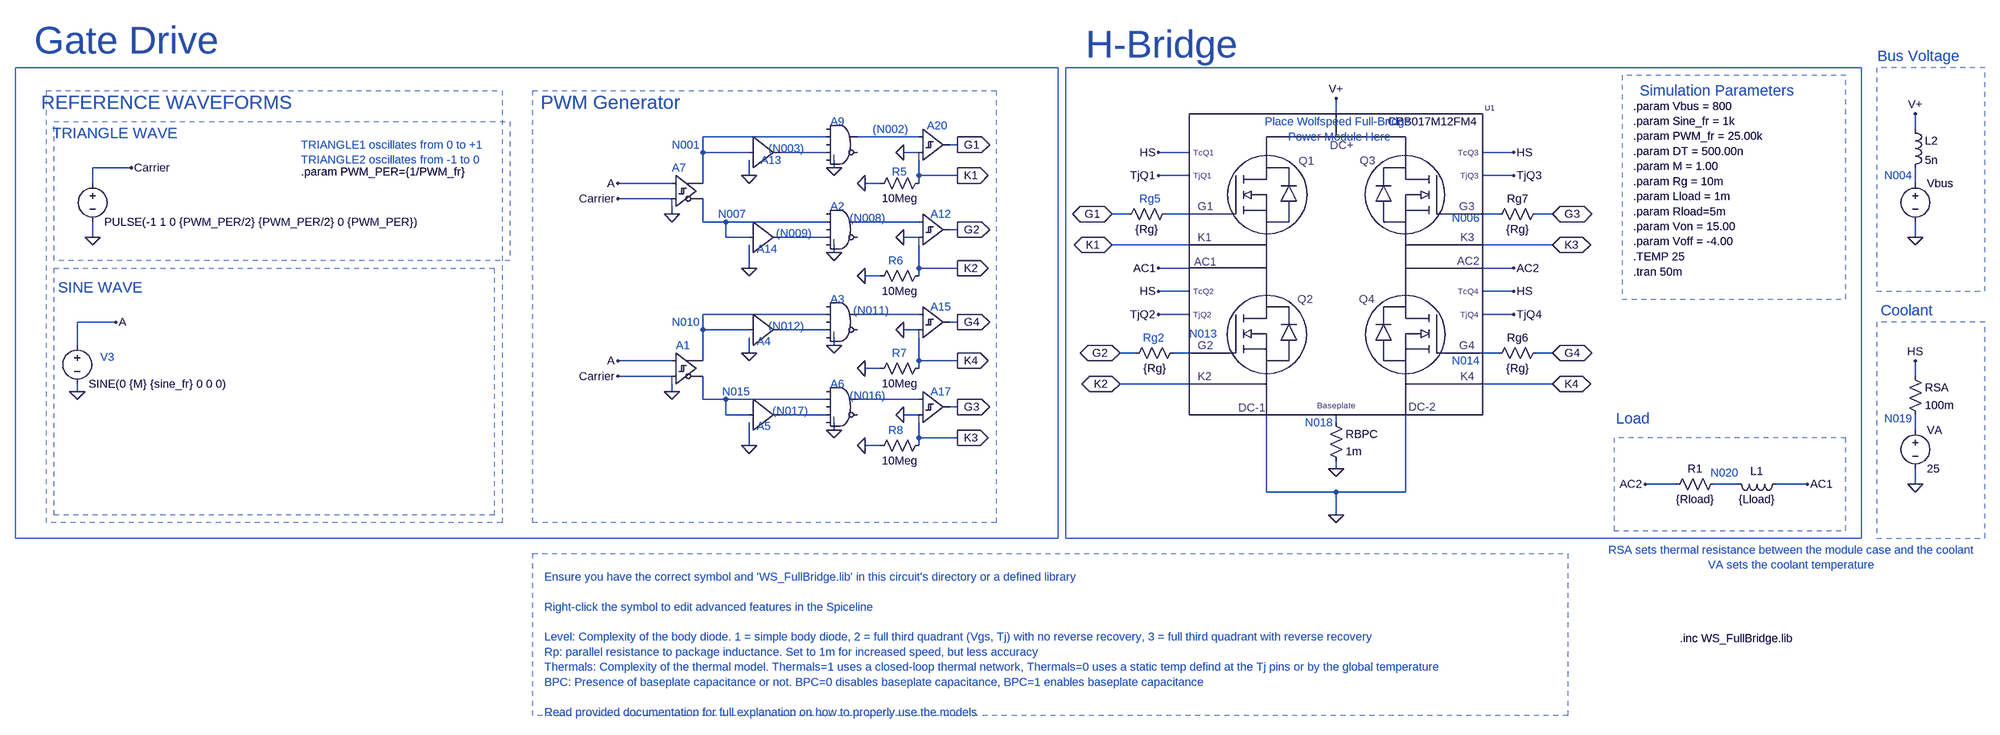
[diagram p0: schematic HBridge_FB.asc]
HBridge_FB.asc, the LTspice schematic file:
Version 4
SHEET 1 8028 1400
WIRE 3744 -2752 3744 -2784
WIRE 4944 -2720 4944 -2752
WIRE 2688 -2704 2432 -2704
WIRE 2880 -2704 2752 -2704
WIRE 2960 -2688 2944 -2688
WIRE 2432 -2672 2432 -2704
WIRE 2528 -2672 2432 -2672
WIRE 2688 -2672 2592 -2672
WIRE 2880 -2672 2848 -2672
WIRE 3440 -2672 3376 -2672
WIRE 4112 -2672 4048 -2672
WIRE 1248 -2640 1168 -2640
WIRE 2704 -2640 2704 -2656
WIRE 2528 -2624 2528 -2656
WIRE 2880 -2624 2880 -2656
WIRE 2960 -2624 2880 -2624
WIRE 3440 -2624 3376 -2624
WIRE 4112 -2624 4048 -2624
WIRE 1168 -2608 1168 -2640
WIRE 2368 -2608 2256 -2608
WIRE 2432 -2608 2432 -2672
WIRE 2800 -2608 2768 -2608
WIRE 2880 -2608 2880 -2624
WIRE 4944 -2608 4944 -2640
WIRE 2368 -2576 2256 -2576
WIRE 2368 -2544 2368 -2560
WIRE 3312 -2544 3280 -2544
WIRE 3440 -2544 3392 -2544
WIRE 4080 -2544 4048 -2544
WIRE 4192 -2544 4160 -2544
WIRE 2432 -2528 2432 -2576
WIRE 2480 -2528 2432 -2528
WIRE 2688 -2528 2480 -2528
WIRE 2880 -2528 2752 -2528
WIRE 2960 -2512 2944 -2512
WIRE 1168 -2496 1168 -2528
WIRE 2480 -2496 2480 -2528
WIRE 2528 -2496 2480 -2496
WIRE 2688 -2496 2592 -2496
WIRE 2880 -2496 2848 -2496
WIRE 4944 -2496 4944 -2528
WIRE 3440 -2480 3280 -2480
WIRE 4192 -2480 4048 -2480
WIRE 2704 -2464 2704 -2480
WIRE 2528 -2432 2528 -2480
WIRE 2880 -2432 2880 -2480
WIRE 2960 -2432 2880 -2432
WIRE 3440 -2432 3376 -2432
WIRE 4112 -2432 4048 -2432
WIRE 2800 -2416 2768 -2416
WIRE 2880 -2416 2880 -2432
WIRE 3440 -2384 3376 -2384
WIRE 4112 -2384 4048 -2384
WIRE 2688 -2336 2432 -2336
WIRE 2880 -2336 2752 -2336
WIRE 3440 -2336 3376 -2336
WIRE 4112 -2336 4048 -2336
WIRE 1216 -2320 1136 -2320
WIRE 2960 -2320 2944 -2320
WIRE 2432 -2304 2432 -2336
WIRE 2528 -2304 2432 -2304
WIRE 2688 -2304 2592 -2304
WIRE 2880 -2304 2848 -2304
WIRE 1136 -2272 1136 -2320
WIRE 2704 -2272 2704 -2288
WIRE 2528 -2256 2528 -2288
WIRE 3328 -2256 3296 -2256
WIRE 3440 -2256 3408 -2256
WIRE 4080 -2256 4048 -2256
WIRE 4192 -2256 4160 -2256
WIRE 2368 -2240 2256 -2240
WIRE 2432 -2240 2432 -2304
WIRE 2880 -2240 2880 -2288
WIRE 2960 -2240 2880 -2240
WIRE 2800 -2224 2768 -2224
WIRE 2880 -2224 2880 -2240
WIRE 2368 -2208 2256 -2208
WIRE 4944 -2208 4944 -2240
WIRE 3440 -2192 3296 -2192
WIRE 4192 -2192 4048 -2192
WIRE 1136 -2176 1136 -2192
WIRE 2368 -2176 2368 -2192
WIRE 2432 -2160 2432 -2208
WIRE 2480 -2160 2432 -2160
WIRE 2688 -2160 2480 -2160
WIRE 2880 -2160 2752 -2160
WIRE 2960 -2144 2944 -2144
WIRE 2480 -2128 2480 -2160
WIRE 2528 -2128 2480 -2128
WIRE 2688 -2128 2592 -2128
WIRE 2880 -2128 2848 -2128
WIRE 3744 -2112 3744 -2128
WIRE 2704 -2096 2704 -2112
WIRE 4944 -2096 4944 -2128
WIRE 2880 -2080 2880 -2112
WIRE 2960 -2080 2880 -2080
WIRE 2528 -2064 2528 -2112
WIRE 2800 -2064 2768 -2064
WIRE 2880 -2064 2880 -2080
WIRE 3744 -2016 3744 -2032
WIRE 4448 -1984 4384 -1984
WIRE 4576 -1984 4528 -1984
WIRE 4720 -1984 4656 -1984
WIRE 4944 -1984 4944 -2016
WIRE 3600 -1968 3600 -2128
WIRE 3744 -1968 3600 -1968
WIRE 3888 -1968 3888 -2128
WIRE 3888 -1968 3744 -1968
WIRE 3744 -1920 3744 -1968
FLAG 1168 -2496 0
FLAG 1248 -2640 Carrier
FLAG 4944 -2752 V+
FLAG 2368 -2544 0
FLAG 2704 -2640 0
FLAG 2704 -2464 0
FLAG 2960 -2688 G1
IOPIN 2960 -2688 Out
FLAG 2960 -2144 G3
IOPIN 2960 -2144 Out
FLAG 2960 -2512 G2
IOPIN 2960 -2512 Out
FLAG 2960 -2320 G4
IOPIN 2960 -2320 Out
FLAG 2960 -2240 K4
IOPIN 2960 -2240 Out
FLAG 2960 -2432 K2
IOPIN 2960 -2432 Out
FLAG 2960 -2624 K1
IOPIN 2960 -2624 Out
FLAG 2960 -2080 K3
IOPIN 2960 -2080 Out
FLAG 2528 -2432 0
FLAG 2848 -2672 0
FLAG 2848 -2496 0
FLAG 2848 -2304 0
FLAG 2848 -2128 0
FLAG 2256 -2608 A
FLAG 2528 -2624 0
FLAG 2368 -2176 0
FLAG 2704 -2272 0
FLAG 2704 -2096 0
FLAG 2528 -2064 0
FLAG 2256 -2240 A
FLAG 2528 -2256 0
FLAG 2768 -2608 0
FLAG 2768 -2416 0
FLAG 2768 -2224 0
FLAG 2768 -2064 0
FLAG 3296 -2256 G2
IOPIN 3296 -2256 BiDir
FLAG 3280 -2544 G1
IOPIN 3280 -2544 BiDir
FLAG 3296 -2192 K2
IOPIN 3296 -2192 BiDir
FLAG 3280 -2480 K1
IOPIN 3280 -2480 BiDir
FLAG 4192 -2544 G3
IOPIN 4192 -2544 BiDir
FLAG 4192 -2256 G4
IOPIN 4192 -2256 BiDir
FLAG 4192 -2192 K4
IOPIN 4192 -2192 BiDir
FLAG 4192 -2480 K3
IOPIN 4192 -2480 BiDir
FLAG 3744 -2784 V+
FLAG 3744 -1920 0
FLAG 4944 -2496 0
FLAG 4720 -1984 AC1
FLAG 1136 -2176 0
FLAG 1216 -2320 A
FLAG 2256 -2576 Carrier
FLAG 2256 -2208 Carrier
FLAG 4944 -2240 HS
FLAG 4944 -1984 0
FLAG 3744 -2016 0
FLAG 4112 -2432 AC2
FLAG 3376 -2432 AC1
FLAG 4384 -1984 AC2
FLAG 4112 -2672 HS
FLAG 3376 -2672 HS
FLAG 3376 -2384 HS
FLAG 4112 -2384 HS
FLAG 4112 -2624 TjQ3
FLAG 4112 -2336 TjQ4
FLAG 3376 -2624 TjQ1
FLAG 3376 -2336 TjQ2
SYMBOL voltage 1168 -2624 R0
WINDOW 123 0 0 Left 2
WINDOW 39 0 0 Left 2
WINDOW 0 24 16 Invisible 2
SYMATTR InstName V2
SYMATTR Value PULSE(-1 1 0 {PWM_PER/2} {PWM_PER/2} 0 {PWM_PER})
SYMBOL diffschmitt 2368 -2656 R0
WINDOW 3 8 120 Invisible 2
WINDOW 0 8 16 Invisible 2
SYMATTR Value tripdt=10n Vt=0
SYMATTR InstName A7
SYMBOL and 2720 -2752 R0
WINDOW 0 16 24 Invisible 2
WINDOW 3 16 112 Invisible 2
SYMATTR InstName A9
SYMATTR Value trise=10n tfall=10n
SYMBOL buf1 2528 -2736 R0
WINDOW 3 8 104 Invisible 2
WINDOW 0 8 32 Invisible 2
SYMATTR Value Td={DT} Trise=10n
SYMATTR InstName A13
SYMBOL buf1 2528 -2560 R0
WINDOW 3 8 104 Invisible 2
WINDOW 0 8 32 Invisible 2
SYMATTR Value Td={DT} Trise=10n
SYMATTR InstName A14
SYMBOL diffschmitt 2368 -2288 R0
WINDOW 3 8 120 Invisible 2
WINDOW 0 8 16 Invisible 2
SYMATTR Value tripdt=10n Vt=0
SYMATTR InstName A1
SYMBOL buf1 2528 -2368 R0
WINDOW 3 8 104 Invisible 2
WINDOW 0 8 32 Invisible 2
SYMATTR Value Td={DT} Trise=10n
SYMATTR InstName A4
SYMBOL buf1 2528 -2192 R0
WINDOW 3 8 104 Invisible 2
WINDOW 0 8 32 Invisible 2
SYMATTR Value Td={DT} Trise=10n
SYMATTR InstName A5
SYMBOL res 2896 -2624 R90
WINDOW 0 0 56 Invisible 2
WINDOW 3 32 56 VTop 2
SYMATTR InstName R5
SYMATTR Value 10Meg
SYMBOL res 2896 -2432 R90
WINDOW 0 0 56 Invisible 2
WINDOW 3 32 56 VTop 2
SYMATTR InstName R6
SYMATTR Value 10Meg
SYMBOL res 2896 -2240 R90
WINDOW 0 0 56 Invisible 2
WINDOW 3 32 56 VTop 2
SYMATTR InstName R7
SYMATTR Value 10Meg
SYMBOL res 2896 -2080 R90
WINDOW 0 0 56 Invisible 2
WINDOW 3 32 56 VTop 2
SYMATTR InstName R8
SYMATTR Value 10Meg
SYMBOL res 3408 -2560 R90
WINDOW 0 0 56 Invisible 2
WINDOW 3 32 56 VTop 2
SYMATTR InstName Rg5
SYMATTR Value {Rg}
SYMBOL res 4064 -2240 R270
WINDOW 0 32 56 VTop 2
WINDOW 3 0 56 VBottom 2
SYMATTR InstName Rg6
SYMATTR Value {Rg}
SYMBOL res 4064 -2528 R270
WINDOW 0 32 56 VTop 2
WINDOW 3 0 56 VBottom 2
SYMATTR InstName Rg7
SYMATTR Value {Rg}
SYMBOL res 3424 -2272 R90
WINDOW 0 0 56 Invisible 2
WINDOW 3 32 56 VTop 2
SYMATTR InstName Rg2
SYMATTR Value {Rg}
SYMBOL ind 4672 -2000 R90
WINDOW 0 5 56 VBottom 2
WINDOW 3 32 56 VTop 2
SYMATTR InstName L1
SYMATTR Value {Lload}
SYMBOL res 4544 -2000 R90
WINDOW 0 0 56 VBottom 2
WINDOW 3 32 56 VTop 2
SYMATTR InstName R1
SYMATTR Value {Rload}
SYMBOL voltage 1136 -2288 R0
WINDOW 123 0 0 Left 2
WINDOW 39 0 0 Left 2
WINDOW 0 24 16 Invisible 2
SYMATTR InstName V3
SYMATTR Value SINE(0 {M} {sine_fr} 0 0 0)
SYMBOL diffschmtbuf 2880 -2752 R0
WINDOW 3 8 120 Invisible 2
WINDOW 0 8 16 Invisible 2
SYMATTR Value Vhigh={Von} Vt=1m tripdt=10n Vlow={Voff}
SYMATTR InstName A20
SYMBOL diffschmtbuf 2880 -2576 R0
WINDOW 3 8 120 Invisible 2
WINDOW 0 8 16 Invisible 2
SYMATTR Value Vhigh={Von} Vt=1m tripdt=10n Vlow={Voff}
SYMATTR InstName A12
SYMBOL diffschmtbuf 2880 -2384 R0
WINDOW 3 8 120 Invisible 2
WINDOW 0 8 16 Invisible 2
SYMATTR Value Vhigh={Von} Vt=1m tripdt=10n Vlow={Voff}
SYMATTR InstName A15
SYMBOL diffschmtbuf 2880 -2208 R0
WINDOW 3 8 120 Invisible 2
WINDOW 0 8 16 Invisible 2
SYMATTR Value Vhigh={Von} Vt=1m tripdt=10n Vlow={Voff}
SYMATTR InstName A17
SYMBOL and 2720 -2576 R0
WINDOW 0 16 24 Invisible 2
WINDOW 3 16 112 Invisible 2
SYMATTR InstName A2
SYMATTR Value trise=10n tfall=10n
SYMBOL and 2720 -2384 R0
WINDOW 0 16 24 Invisible 2
WINDOW 3 16 112 Invisible 2
SYMATTR InstName A3
SYMATTR Value trise=10n tfall=10n
SYMBOL and 2720 -2208 R0
WINDOW 0 16 24 Invisible 2
WINDOW 3 16 112 Invisible 2
SYMATTR InstName A6
SYMATTR Value trise=10n tfall=10n
SYMBOL voltage 4944 -2624 R0
WINDOW 3 24 96 Invisible 2
WINDOW 123 0 0 Left 0
WINDOW 39 0 0 Left 0
SYMATTR Value PULSE(0 {Vbus} 0 10n 10n 1)
SYMATTR InstName Vbus
SYMBOL res 4928 -2224 R0
SYMATTR InstName RSA
SYMATTR Value 100m
SYMBOL voltage 4944 -2112 R0
SYMATTR InstName VA
SYMATTR Value 25
SYMBOL res 3728 -2128 R0
SYMATTR InstName RBPC
SYMATTR Value 1m
SYMBOL ind 4928 -2736 R0
SYMATTR InstName L2
SYMATTR Value 5n
SYMATTR SpiceLine Rpar=100
SYMBOL CBB017M12FM4_LTspice 3328 -2160 R0
SYMATTR InstName U1
TEXT 1600 -2632 Left 2 !.param PWM_PER={1/PWM_fr}
TEXT 1600 -2688 Left 2 ;TRIANGLE1 oscillates from 0 to +1\nTRIANGLE2 oscillates from -1 to 0
TEXT 1320 -2776 Center 4 ;REFERENCE WAVEFORMS
TEXT 1184 -2392 Center 3 ;SINE WAVE
TEXT 1216 -2712 Center 3 ;TRIANGLE WAVE
TEXT 1240 -2904 Center 6 ;Gate Drive
TEXT 3384 -2896 Center 6 ;H-Bridge
TEXT 2096 -2776 Left 4 ;PWM Generator
TEXT 4536 -2800 Center 3 ;Simulation Parameters
TEXT 4360 -2424 Left 2 !.tran 50m
TEXT 4360 -2768 Left 2 !.param Vbus = 800\n.param Sine_fr = 1k\n.param PWM_fr = 25.00k\n.param DT = 500.00n\n.param M = 1.00\n.param Rg = 10m\n.param Lload = 1m\n.param Rload=5m\n.param Von = 15.00\n.param Voff = -4.00
TEXT 4360 -2456 Left 2 !.TEMP 25
TEXT 4952 -2872 Center 3 ;Bus Voltage
TEXT 4360 -2120 Center 3 ;Load
TEXT 4928 -2344 Center 3 ;Coolant
TEXT 3752 -2720 Center 2 ;Place Wolfspeed Full-Bridge \nPower Module Here
TEXT 4688 -1832 Center 2 ;RSA sets thermal resistance between the module case and the coolant\nVA sets the coolant temperature
TEXT 2104 -1792 Left 2 ;Ensure you have the correct symbol and 'WS_FullBridge.lib' in this circuit's directory or a defined library\n \nRight-click the symbol to edit advanced features in the Spiceline\n \nLevel: Complexity of the body diode. 1 = simple body diode, 2 = full third quadrant (Vgs, Tj) with no reverse recovery, 3 = full third quadrant with reverse recovery\nRp: parallel resistance to package inductance. Set to 1m for increased speed, but less accuracy\nThermals: Complexity of the thermal model. Thermals=1 uses a closed-loop thermal network, Thermals=0 uses a static temp defind at the Tj pins or by the global temperature\nBPC: Presence of baseplate capacitance or not. BPC=0 disables baseplate capacitance, BPC=1 enables baseplate capacitance\n \nRead provided documentation for full explanation on how to properly use the models
TEXT 4456 -1664 Left 2 !.inc WS_FullBridge.lib
TEXT 2824 -2632 Left 2 ;R5
TEXT 2816 -2448 Left 2 ;R6
TEXT 2824 -2256 Left 2 ;R7
TEXT 2816 -2096 Left 2 ;R8
TEXT 3336 -2576 Left 2 ;Rg5
TEXT 3984 -2240 Left 2 ;N014
TEXT 3984 -2536 Left 2 ;N006
TEXT 3344 -2288 Left 2 ;Rg2
TEXT 3440 -2296 Left 2 ;N013
TEXT 4520 -2008 Left 2 ;N020
TEXT 1184 -2248 Left 2 ;V3
TEXT 4880 -2624 Left 2 ;N004
TEXT 4880 -2120 Left 2 ;N019
TEXT 3680 -2112 Left 2 ;N018
TEXT 2368 -2640 Left 2 ;A7
TEXT 2376 -2272 Left 2 ;A1
TEXT 2552 -2656 Left 2 ;A13
TEXT 2696 -2736 Left 2 ;A9
TEXT 2896 -2728 Left 2 ;A20
TEXT 2544 -2472 Left 2 ;A14
TEXT 2696 -2560 Left 2 ;A2
TEXT 2904 -2544 Left 2 ;A12
TEXT 2904 -2352 Left 2 ;A15
TEXT 2904 -2176 Left 2 ;A17
TEXT 2696 -2368 Left 2 ;A3
TEXT 2696 -2192 Left 2 ;A6
TEXT 2544 -2280 Left 2 ;A4
TEXT 2544 -2104 Left 2 ;A5
TEXT 2368 -2320 Left 2 ;N010
TEXT 2472 -2176 Left 2 ;N015
TEXT 2368 -2688 Left 2 ;N001
TEXT 2464 -2544 Left 2 ;N007
TEXT 2568 -2680 Left 2 ;(N003)
TEXT 2784 -2720 Left 2 ;(N002)
TEXT 2584 -2504 Left 2 ;(N009)
TEXT 2568 -2312 Left 2 ;(N012)
TEXT 2576 -2136 Left 2 ;(N017)
TEXT 2736 -2536 Left 2 ;(N008)
TEXT 2744 -2344 Left 2 ;(N011)
TEXT 2736 -2168 Left 2 ;(N016)
RECTANGLE Normal 4832 -2848 3184 -1872
RECTANGLE Normal 2000 -1920 1088 -2432 2
RECTANGLE Normal 2032 -2448 1088 -2736 2
RECTANGLE Normal 2016 -1904 1072 -2800 1
RECTANGLE Normal 3168 -2848 1008 -1872
RECTANGLE Normal 3040 -1904 2080 -2800 1
RECTANGLE Normal 4800 -2832 4336 -2368 2
RECTANGLE Normal 5088 -2848 4864 -2384 1
RECTANGLE Normal 4800 -2080 4320 -1888 1
RECTANGLE Normal 5088 -2320 4864 -1872 1
RECTANGLE Normal 4048 -2128 3440 -2752
RECTANGLE Normal 4224 -1504 2080 -1840 2

The netlist it stands for:
* HBridge_FB.asc
V2 Carrier 0 PULSE(-1 1 0 {PWM_PER/2} {PWM_PER/2} 0 {PWM_PER})
A7 A Carrier 0 0 0 N007 N001 0 SCHMITT tripdt=10n Vt=0
A9 0 N001 0 N003 0 0 N002 0 AND trise=10n tfall=10n
A13 N001 0 0 0 0 0 N003 0 BUF Td={DT} Trise=10n
A14 N007 0 0 0 0 0 N009 0 BUF Td={DT} Trise=10n
A1 A Carrier 0 0 0 N015 N010 0 SCHMITT tripdt=10n Vt=0
A4 N010 0 0 0 0 0 N012 0 BUF Td={DT} Trise=10n
A5 N015 0 0 0 0 0 N017 0 BUF Td={DT} Trise=10n
R5 K1 0 10Meg
R6 K2 0 10Meg
R7 K4 0 10Meg
R8 K3 0 10Meg
Rg5 N005 G1 {Rg}
Rg6 N014 G4 {Rg}
Rg7 N006 G3 {Rg}
Rg2 N013 G2 {Rg}
L1 AC1 N020 {Lload}
R1 N020 AC2 {Rload}
V3 A 0 SINE(0 {M} {sine_fr} 0 0 0)
A20 N002 0 K1 K1 K1 K1 G1 K1 SCHMITT Vhigh={Von} Vt=1m tripdt=10n Vlow={Voff}
A12 N008 0 K2 K2 K2 K2 G2 K2 SCHMITT Vhigh={Von} Vt=1m tripdt=10n Vlow={Voff}
A15 N011 0 K4 K4 K4 K4 G4 K4 SCHMITT Vhigh={Von} Vt=1m tripdt=10n Vlow={Voff}
A17 N016 0 K3 K3 K3 K3 G3 K3 SCHMITT Vhigh={Von} Vt=1m tripdt=10n Vlow={Voff}
A2 0 N007 0 N009 0 0 N008 0 AND trise=10n tfall=10n
A3 0 N010 0 N012 0 0 N011 0 AND trise=10n tfall=10n
A6 0 N015 0 N017 0 0 N016 0 AND trise=10n tfall=10n
Vbus N004 0 PULSE(0 {Vbus} 0 10n 10n 1)
RSA HS N019 100m
VA N019 0 25
RBPC N018 0 1m
L2 V+ N004 5n Rpar=100
XU1 V+ 0 0 AC1 AC2 N005 N013 N006 N014 K1 K2 K3 K4 TjQ1 TjQ2 TjQ3 TjQ4 HS HS HS HS N018 CBB017M12FM4 Thermals=1 BPC=0 level=3 Rp=100  ; pins DC+ DC-1 DC-2 AC1 AC2 G1 G2 G3 G4 K1 K2 K3 K4 TjQ1 TjQ2 TjQ3 TjQ4 TcQ1 TcQ2 TcQ3 TcQ4 Baseplate
.param PWM_PER={1/PWM_fr}
* TRIANGLE1 oscillates from 0 to +1
* TRIANGLE2 oscillates from -1 to 0
* REFERENCE WAVEFORMS
* SINE WAVE
* TRIANGLE WAVE
* Gate Drive
* H-Bridge
* PWM Generator
* Simulation Parameters
.tran 50m
.param Vbus = 800
.param Sine_fr = 1k
.param PWM_fr = 25.00k
.param DT = 500.00n
.param M = 1.00
.param Rg = 10m
.param Lload = 1m
.param Rload=5m
.param Von = 15.00
.param Voff = -4.00
.TEMP 25
* Bus Voltage
* Load
* Coolant
* Place Wolfspeed Full-Bridge
* Power Module Here
* RSA sets thermal resistance between the module case and the coolant
* VA sets the coolant temperature
* Ensure you have the correct symbol and 'WS_FullBridge.lib' in this circuit's directory or a defined library
* Right-click the symbol to edit advanced features in the Spiceline
* Level: Complexity of the body diode. 1 = simple body diode, 2 = full third quadrant (Vgs, Tj) with no reverse recovery, 3 = full third quadrant with reverse recovery
* Rp: parallel resistance to package inductance. Set to 1m for increased speed, but less accuracy
* Thermals: Complexity of the thermal model. Thermals=1 uses a closed-loop thermal network, Thermals=0 uses a static temp defind at the Tj pins or by the global temperature
* BPC: Presence of baseplate capacitance or not. BPC=0 disables baseplate capacitance, BPC=1 enables baseplate capacitance
* Read provided documentation for full explanation on how to properly use the models
.inc WS_FullBridge.lib
* R5
* R6
* R7
* R8
* Rg5
* N014
* N006
* Rg2
* N013
* N020
* V3
* N004
* N019
* N018
* A7
* A1
* A13
* A9
* A20
* A14
* A2
* A12
* A15
* A17
* A3
* A6
* A4
* A5
* N010
* N015
* N001
* N007
* (N003)
* (N002)
* (N009)
* (N012)
* (N017)
* (N008)
* (N011)
* (N016)
.lib WS_FullBridge.lib
.backanno
.end